# EasyEDA schematic HW1_1_b.json
TITLE: Sheet_1; REV: 1.0; Date: 2020-11-04; Sheet: 1/1; Drawn By: gokbeykeskin_4066; Company: Your Company
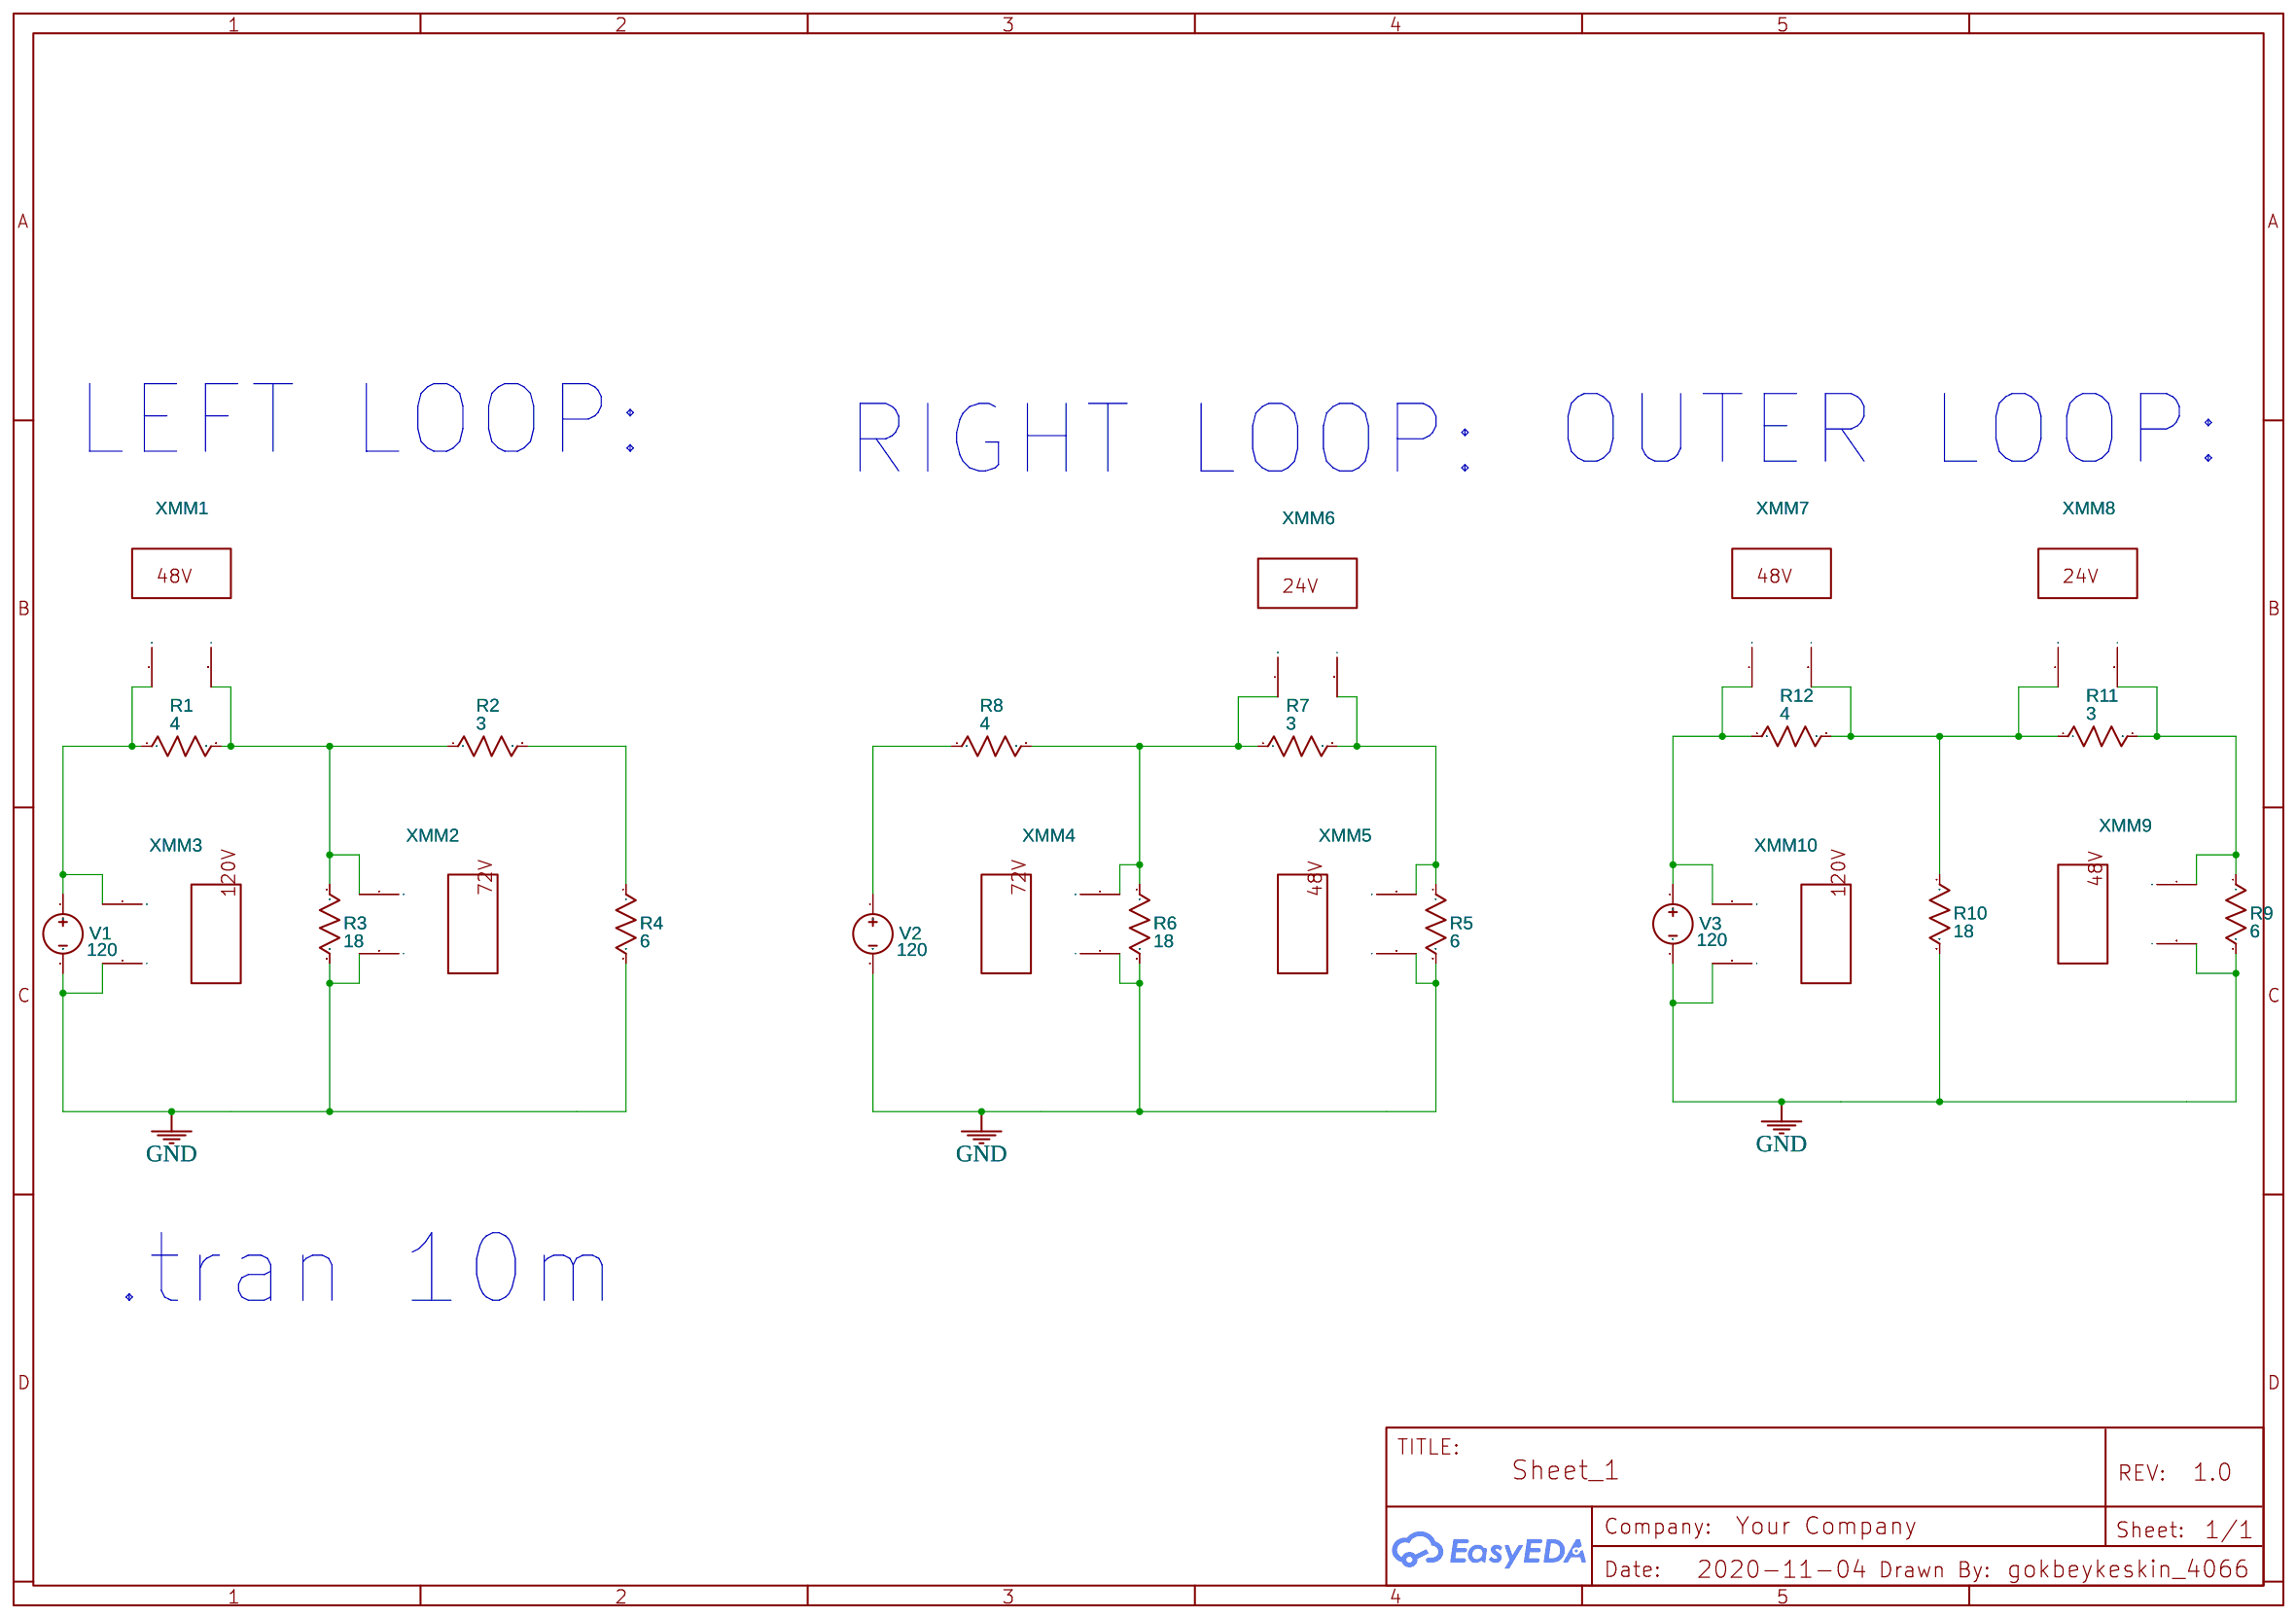
[diagram p0: schematic sheet]

## Parts
R1  4  [AXIAL-0.3]
R2  3  [AXIAL-0.3]
R3  18  [AXIAL-0.3]
R4  6  [AXIAL-0.3]
R5  6  [AXIAL-0.3]
R6  18  [AXIAL-0.3]
R7  3  [AXIAL-0.3]
R8  4  [AXIAL-0.3]
R9  6  [AXIAL-0.3]
R10  18  [AXIAL-0.3]
R11  3  [AXIAL-0.3]
R12  4  [AXIAL-0.3]
V1  120  [HDR1X2]
V2  120  [HDR1X2]
V3  120  [HDR1X2]
XMM1  Multimeter
XMM2  Multimeter
XMM3  Multimeter
XMM4  Multimeter
XMM5  Multimeter
XMM6  Multimeter
XMM7  Multimeter
XMM8  Multimeter
XMM9  Multimeter
XMM10  Multimeter

## Library data of the parts
R1-R12 = Resistor_US: Resistance: 1k; Contributor: EasyEDA; Supplier: YUJING
V1-V3 = VDC: Contributor: EasyEDA; sim: true
XMM1-XMM10 = MULTIMETER: Supplier: LCSC; Multimeter Type: Voltmeter; Power Type: AC; Voltmeter resistance: 10μ; Ammeter resistance: 1G; NameDisplay: 0; Contributor: EasyEDA; sim: true

## Nets
GND: R3.2 R4.2 R5.2 R6.2 R9.2 R10.2 V1.2 V2.2 V3.2 XMM2.2(I) XMM3.2(I) XMM4.2(I) XMM5.2(I) XMM9.2(I) XMM10.2(I)
Net-(R1-1): R1.1 V1.1 XMM1.1(+) XMM3.1(+)
Net-(R1-2): R1.2 R2.1 R3.1 XMM1.2(I) XMM2.1(+)
Net-(R2-2): R2.2 R4.1
Net-(R5-1): R5.1 R7.2 XMM5.1(+) XMM6.2(I)
Net-(R6-1): R6.1 R7.1 R8.2 XMM4.1(+) XMM6.1(+)
Net-(R8-1): R8.1 V2.1
Net-(R9-1): R9.1 R11.2 XMM8.2(I) XMM9.1(+)
Net-(R10-1): R10.1 R11.1 R12.2 XMM7.2(I) XMM8.1(+)
Net-(R12-1): R12.1 V3.1 XMM7.1(+) XMM10.1(+)

## Notes on the sheet
- LEFT LOOP:
- OUTER LOOP:
- RIGHT LOOP:
- .tran 10m
